# EasyEDA schematic 1-Schematic_power supply.json
TITLE: Sheet_1; REV: 1.0; Date: 2019-05-14; Sheet: 1/1; Drawn By: yixingqie; Company: Your Company
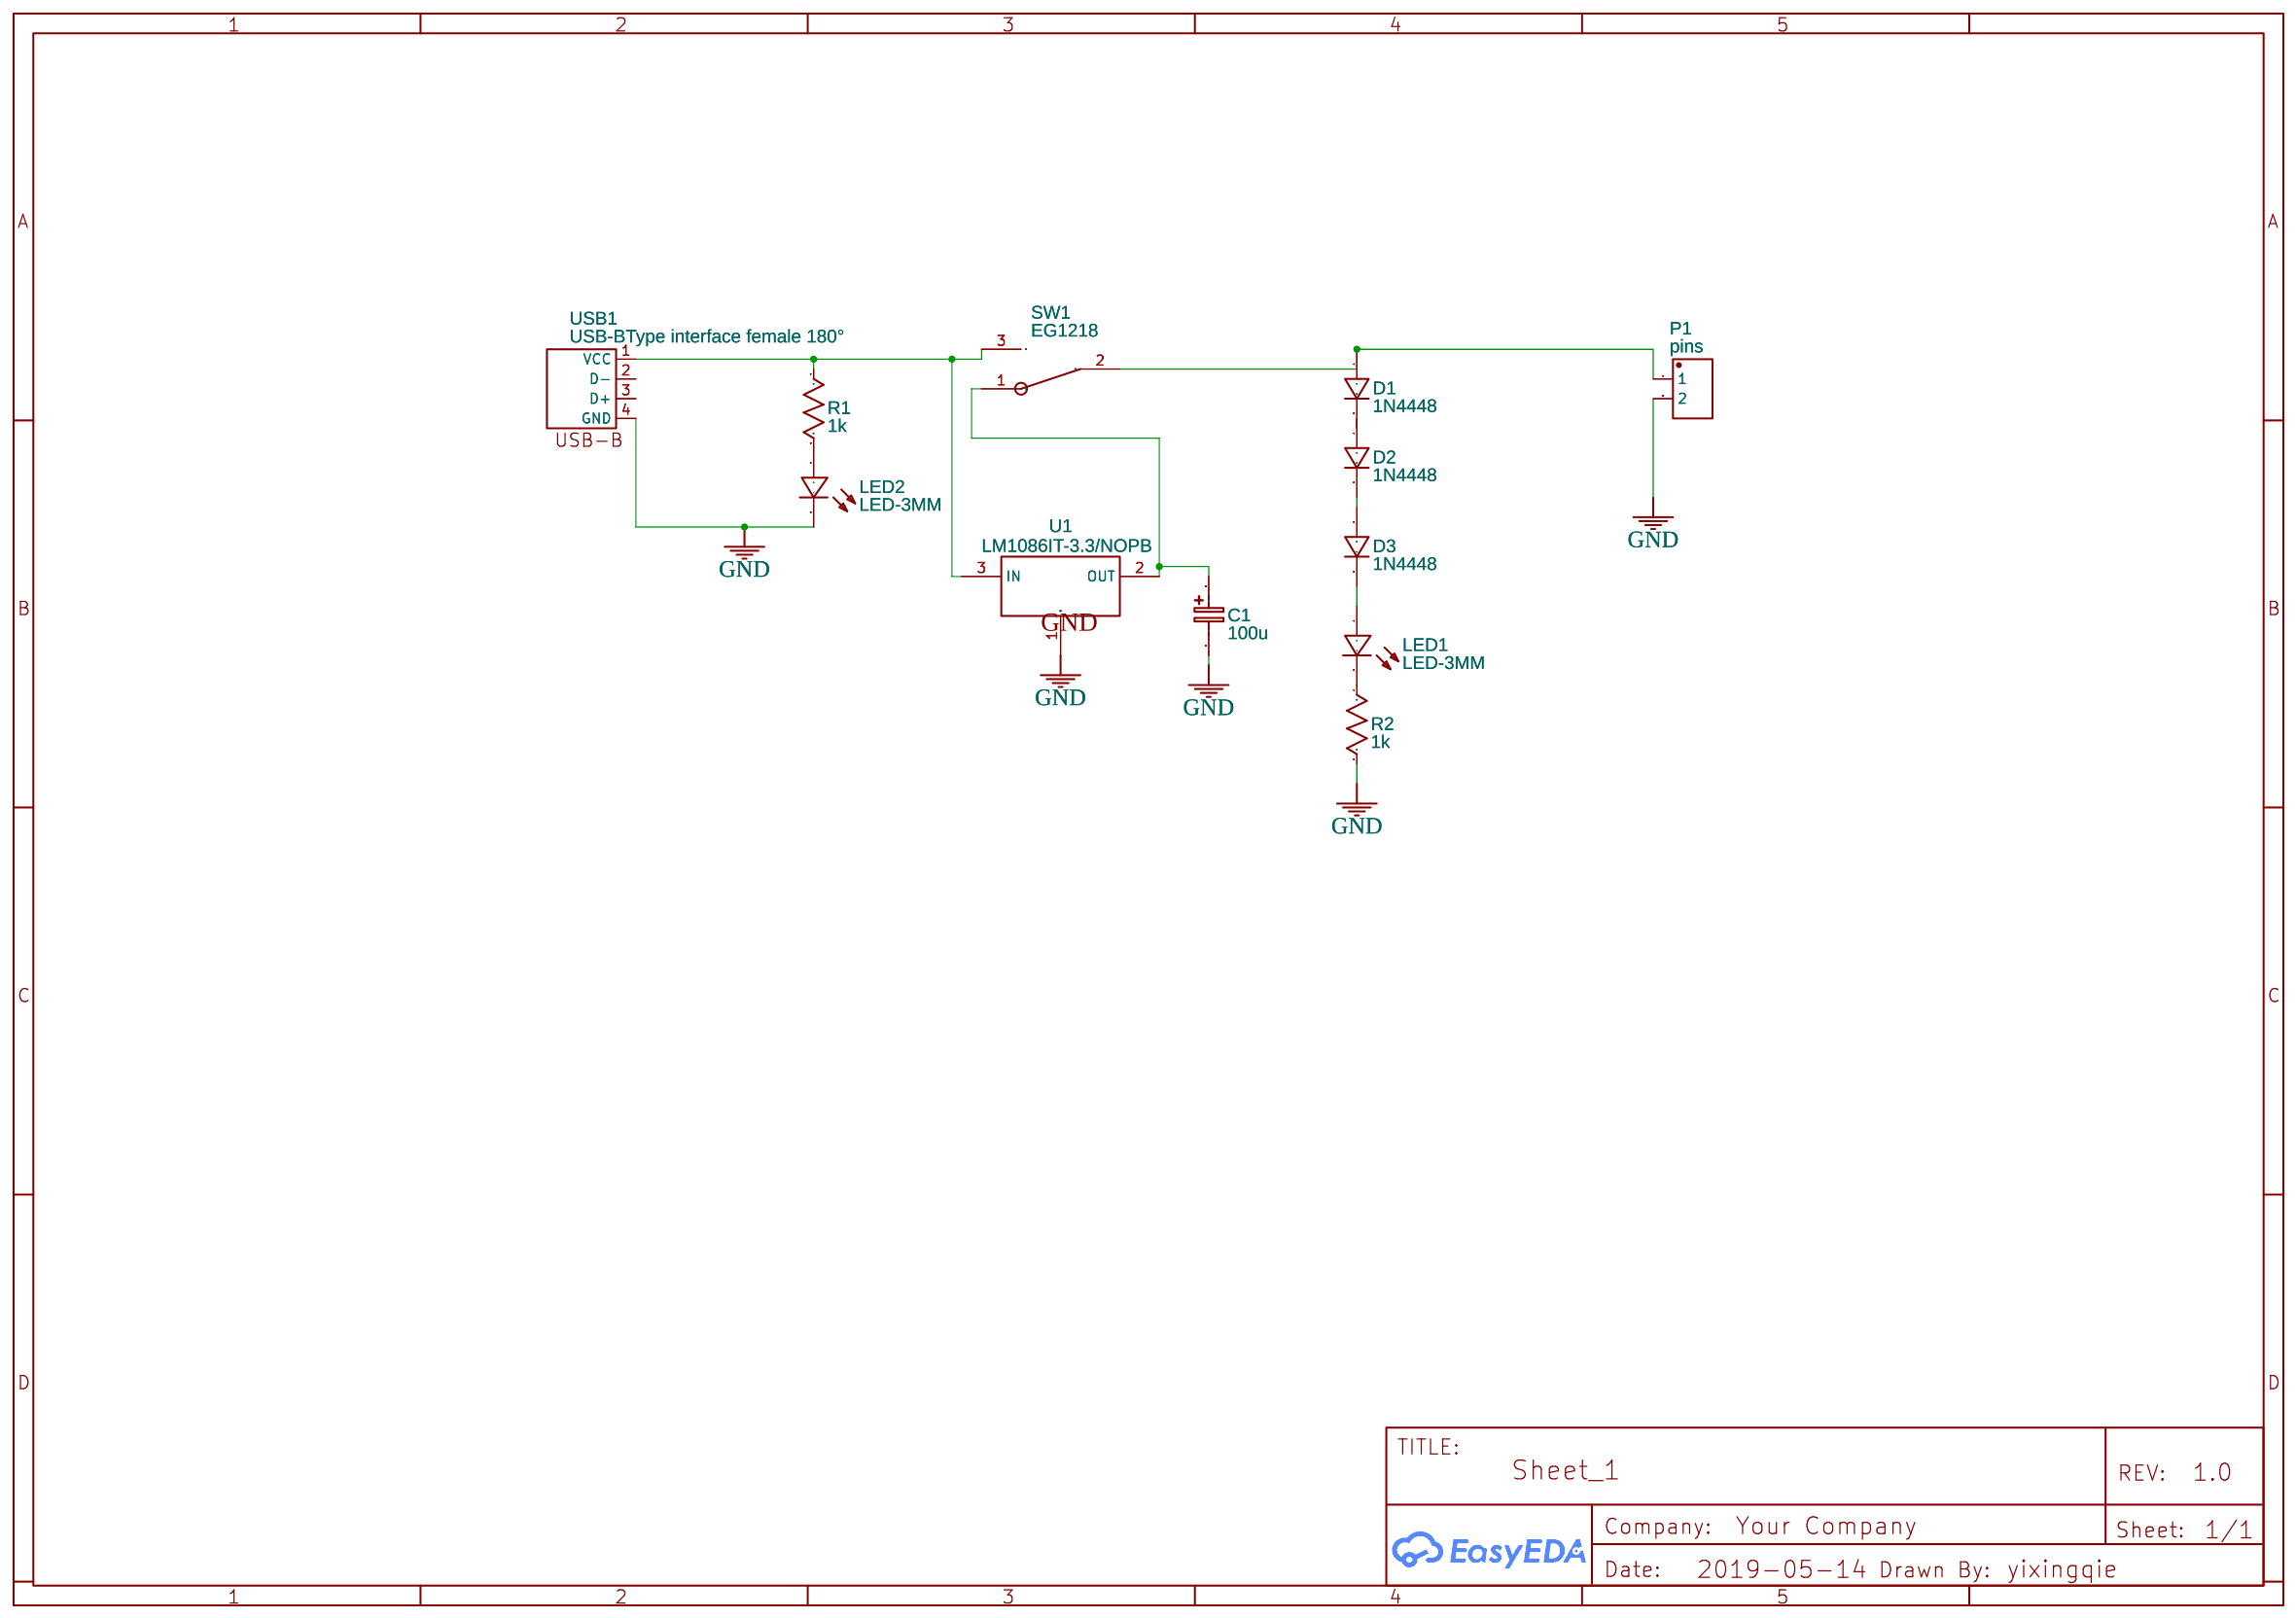
[diagram p0: schematic sheet]

## Parts
C1  100u  [CAP-D3.0XF1.5]
D1  1N4448  [DO-35]
D2  1N4448  [DO-35]
D3  1N4448  [DO-35]
LED1  LED-3MM  [LED-3MM/2.54]
LED2  LED-3MM  [LED-3MM/2.54]
P1  pins  [WJ2EDGVC-5.08-2P]
R1  1k  [AXIAL-0.3]
R2  1k  [AXIAL-0.3]
SW1  EG1218  [EG1218_1]
U1  LM1086IT-3.3/NOPB  [TO-220(TO-220-3)]
USB1  USB-BType interface female 180°  [USB-B-1]

## Library data of the parts
C1 = Cap_Electrolytic(TH)_D3.0XF1.5_EU: Contributor: EasyEDA; Manufacturer Part: ?
D1-D3 = -: Supplier: LCSC; Manufacturer: SEMTECH; image: //image.lceda.cn/szlcsc/C54037.jpg; Supplier Part: C54037
LED1 LED2 = -: Supplier: LCSC; Manufacturer: EVERLIGHT; Manufacturer Part: 204-10SURD/S530-A3; Supplier Part: C99772
P1 = -: Supplier: LCSC; Manufacturer: ReliaPro; image: //image.lceda.cn/szlcsc/C8445.jpg; Supplier Part: C8445
R1 R2 = Res_AXIAL-0.3(1/8W)_US: Manufacturer Part: ?
SW1 = -: Supplier: LCSC; Supplier Part: C273394; Manufacturer: E-Switch; Contributor: LCSC
U1 = -: Supplier: LCSC; Manufacturer: TI; Contributor: LCSC; Supplier Part: C130173
USB1 = -: Supplier: LCSC; Supplier Part: C26234

## Nets
GND: C1.2 LED2.2(-) P1.2 R2.2 U1.1(GND) USB1.4(GND)
Net-(C1-1): C1.1 SW1.1 U1.2(OUT)
Net-(D1-1): D1.1(A) P1.1 SW1.2
Net-(D1-2): D1.2(K) D2.1(A)
Net-(D2-2): D2.2(K) D3.1(A)
Net-(D3-2): D3.2(K) LED1.1(+)
Net-(LED1-2): LED1.2(-) R2.1
Net-(LED2-1): LED2.1(+) R1.2
Net-(R1-1): R1.1 SW1.3 U1.3(IN) USB1.1(VCC)

Not connected (* = marked no-connect by the designer): USB1 2(D-) 3(D+)
